# Altium schematic sheet Display.SchDoc: 03 Display
size A4; Address1: Dệt May Huế; Address2: Nhà máy Sợi; Address3: Xuân Anh - Phước Sơn
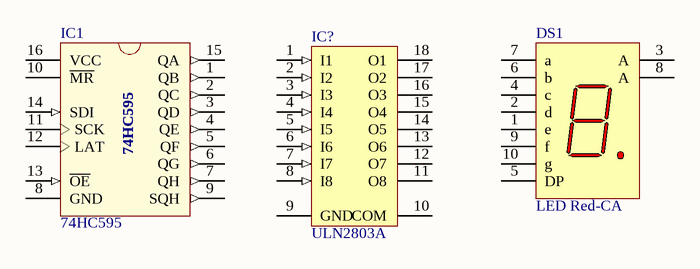
[diagram p0: Display.SchDoc]

## Parts
DS1  LED Red-CA  [7SEGS]
IC1  74HC595  [DIP16/W0.3]
IC?  ULN2803A

## Nets

Not connected (* = marked no-connect by the designer): DS1 1(e) 2(d) 3(A) 4(c) 5(DP) 6(b) 7(a) 8(A) 9(f) 10(g); IC1 1(QB) 2(QC) 3(QD) 4(QE) 5(QF) 6(QG) 7(QH) 8(GND) 9(SQH) 10(~{MR}) 11(SCK) 12(LAT) 13(~{OE}) 14(SDI) 15(QA) 16(VCC); IC? 1(I1) 2(I2) 3(I3) 4(I4) 5(I5) 6(I6) 7(I7) 8(I8) 9(GND) 10(COM) 11(O8) 12(O7) 13(O6) 14(O5) 15(O4) 16(O3) 17(O2) 18(O1)

## Notes on the sheet
- Title
- Size:
- Date:
- A4
- Number:
- Time:
- Revision:
- Sheet
- of
- File:

## Library data of the parts
DS1 = LED Red-CA: 7.62 mm Black Surface HER 7-Segment Display: CA, RH DP; MinimumIntensity: 360 ucd; Note: IF = 5 mA; Colour: High Efficiency Red (HER); Note: Pins 1 and 6 are redundant Anodes.; Published: 8-Jun-2000; LatestRevisionDate: 17-Dec-2003; LatestRevisionNote: Schematic revised, PCB Footprint replaced.; DatasheetVersion: 19-Feb-2002; PackageVersion: 11-Feb-2002; PackageReference: A; Publisher: Altium Limited; PackageDescription: LED, 7-Segment Display, 7.62 mm, RHD; 10 Leads; Row Space 5.08 mm; Pitch 2.54 mm; ComponentLink1Description: Manufacturer Link; ComponentLink1URL: http://www.agilent.com/
IC1 = 74HC595: 8 Bit Serial input - Parallel Output; Value: 74HC595
IC? = ULN2803A: High-Voltage, High-Current Darlington Array; LatestRevisionNote: Stylized 3D Model Added.; Publisher: Altium Limited; Value: ULN2803A